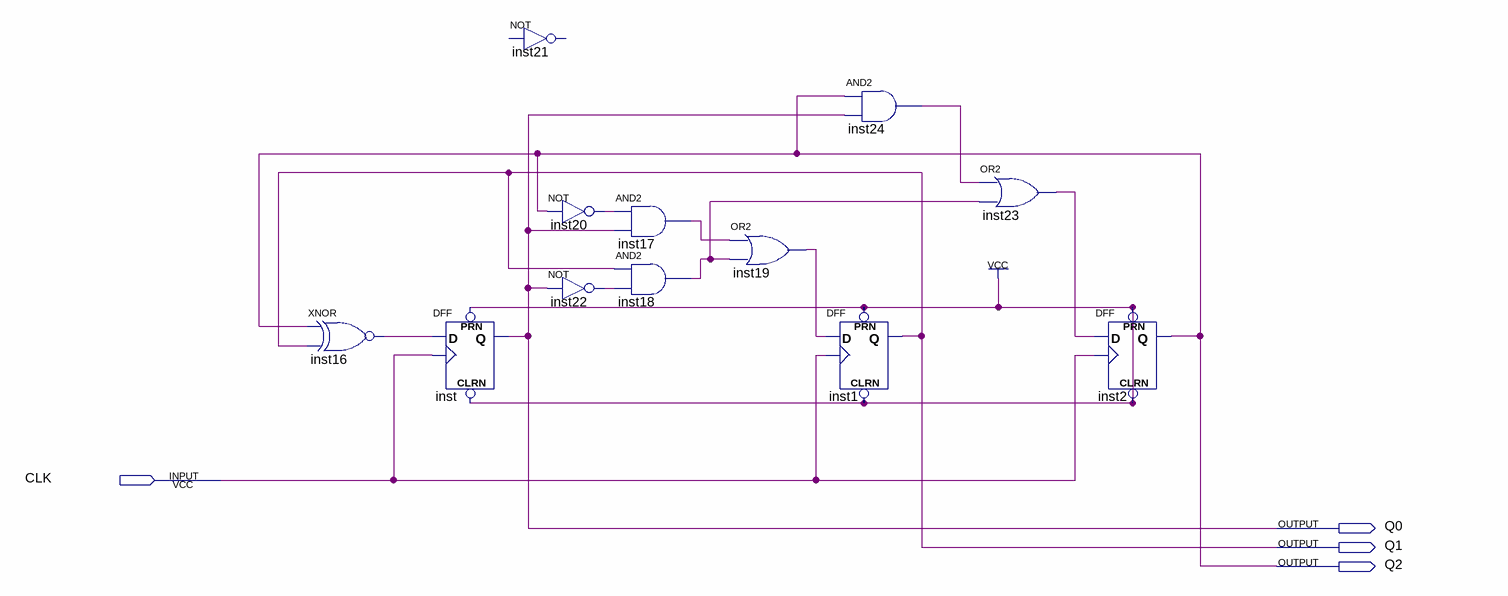
[diagram p0: schematic sheet]
// Quartus schematic GrayCnt3.bdf as structural Verilog: 12 symbols, 4 pins
module GrayCnt3 (
  input  CLK,
  output Q0,
  output Q1,
  output Q2
);

  wire inst16_out, inst17_out, inst18_out, inst19_out, inst20_out, inst22_out, inst23_out, inst24_out;

  xnor inst16 (inst16_out, Q2, Q1);
  DFF inst (.CLRN(1'b1), .CLK(CLK), .D(inst16_out), .PRN(1'b1), .Q(Q0));
  // NOT inst21 is placed but not wired
  not inst20 (inst20_out, Q2);
  not inst22 (inst22_out, Q0);
  and inst17 (inst17_out, inst20_out, Q0);
  and inst18 (inst18_out, Q1, inst22_out);
  or inst19 (inst19_out, inst17_out, inst18_out);
  and inst24 (inst24_out, Q2, Q0);
  DFF inst1 (.CLRN(1'b1), .CLK(CLK), .D(inst19_out), .PRN(1'b1), .Q(Q1));
  or inst23 (inst23_out, inst24_out, inst18_out);
  DFF inst2 (.CLRN(1'b1), .CLK(CLK), .D(inst23_out), .PRN(1'b1), .Q(Q2));
endmodule
